# Altium schematic sheet SINUX_F1_POWER.SchDoc
size A4
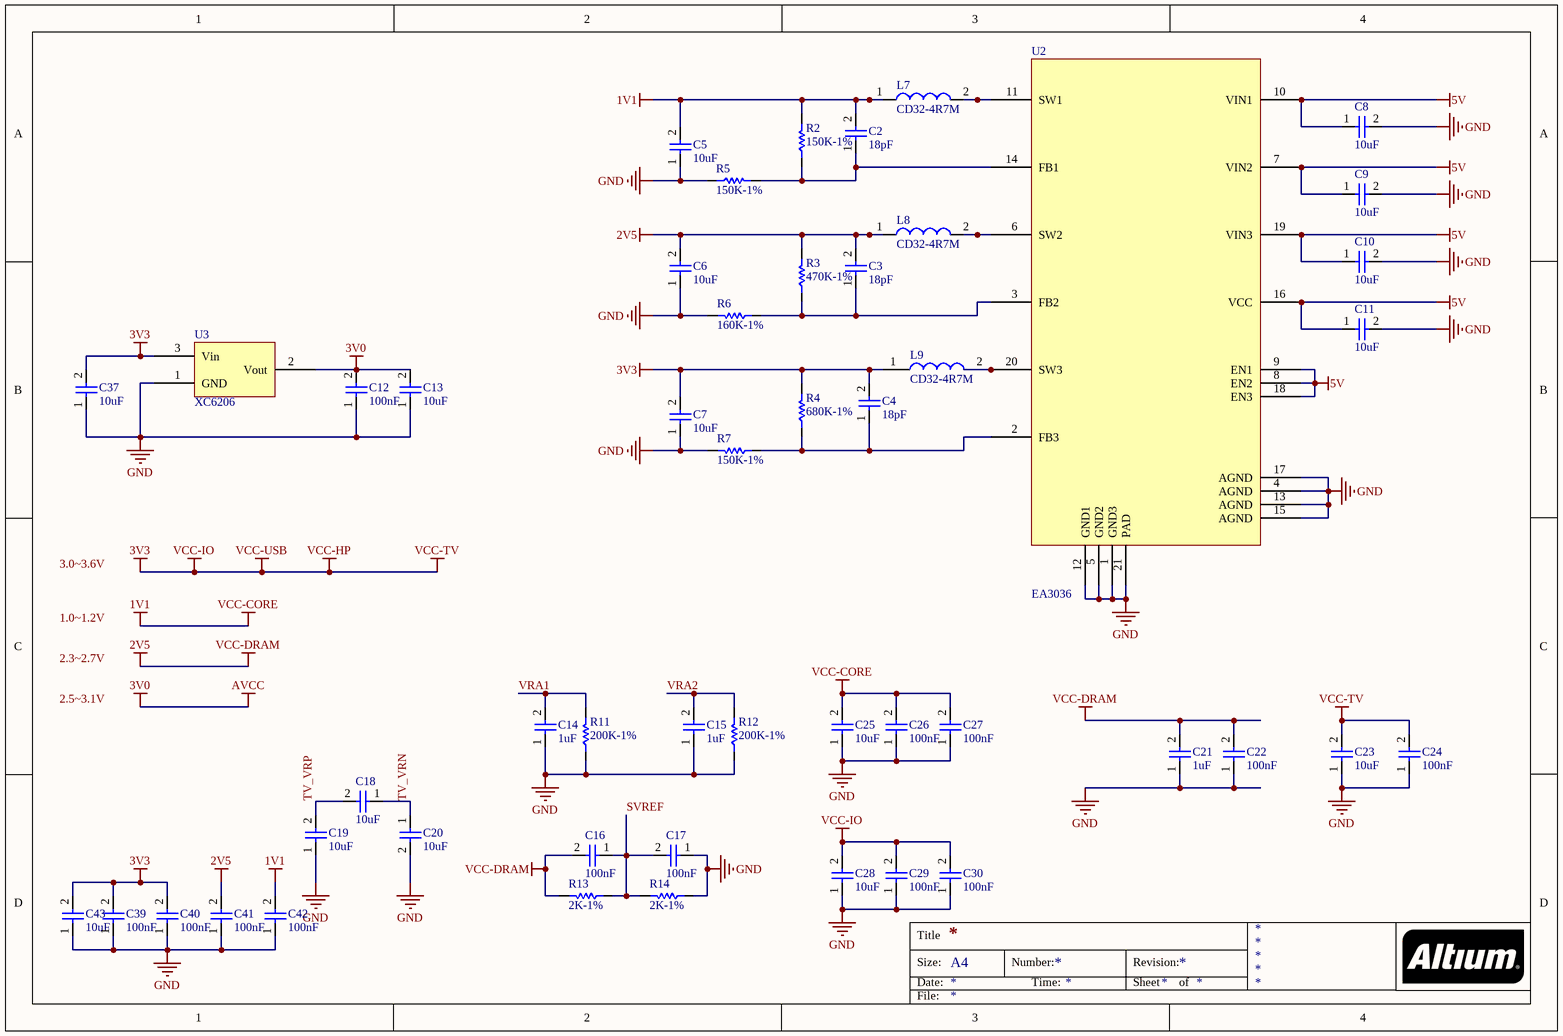
[diagram p0: SINUX_F1_POWER.SchDoc]

## Parts
C2  18pF  [SMD 0805]
C3  18pF  [SMD 0805]
C4  18pF  [SMD 0805]
C5  10uF  [SMD 0805]
C6  10uF  [SMD 0805]
C7  10uF  [SMD 0805]
C8  10uF  [SMD 0805]
C9  10uF  [SMD 0805]
C10  10uF  [SMD 0805]
C11  10uF  [SMD 0805]
C12  100nF  [SMD 0805]
C13  10uF  [SMD 0805]
C14  1uF  [SMD 0805]
C15  1uF  [SMD 0805]
C16  100nF  [SMD 0805]
C17  100nF  [SMD 0805]
C18  10uF  [SMD 0805]
C19  10uF  [SMD 0805]
C20  10uF  [SMD 0805]
C21  1uF  [SMD 0805]
C22  100nF  [SMD 0805]
C23  10uF  [SMD 0805]
C24  100nF  [SMD 0805]
C25  10uF  [SMD 0805]
C26  100nF  [SMD 0805]
C27  100nF  [SMD 0805]
C28  10uF  [SMD 0805]
C29  100nF  [SMD 0805]
C30  100nF  [SMD 0805]
C37  10uF  [SMD 0805]
C39  100nF  [SMD 0805]
C40  100nF  [SMD 0805]
C41  100nF  [SMD 0805]
C42  100nF  [SMD 0805]
C43  10uF  [SMD 0805]
L7  CD32-4R7M  [CD324R7M]
L8  CD32-4R7M  [CD324R7M]
L9  CD32-4R7M  [CD324R7M]
R2  150K-1%  [0805_1/8W]
R3  470K-1%  [0805_1/8W]
R4  680K-1%  [0805_1/8W]
R5  150K-1%  [0805_1/8W]
R6  160K-1%  [0805_1/8W]
R7  150K-1%  [0805_1/8W]
R11  200K-1%  [0805_1/8W]
R12  200K-1%  [0805_1/8W]
R13  2K-1%  [0805_1/8W]
R14  2K-1%  [0805_1/8W]
U2  EA3036  [QFN40P300X300X80-21N]
U3  XC6206  [SOT95P280X130-3N]

## Nets
1V1: C2.2 C5.2 C25.2 C26.2 C27.2 C42.2 L7.1 R2.2  [also labelled VCC-CORE]
2V5: C3.2 C6.2 C16.2 C21.2 C22.2 C41.2 L8.1 R3.2 R13.2  [also labelled VCC-DRAM]
3V0: C12.2 C13.2 U3.2(Vout)  [also labelled AVCC]
3V3: C4.2 C7.2 C23.2 C24.2 C28.2 C29.2 C30.2 C37.2 C39.2 C40.2 C43.2 L9.1 R4.2 U3.3(Vin)  [also labelled VCC-HP, VCC-IO, VCC-TV, VCC-USB]
5V: C8.1 C9.1 C10.1 C11.1 U2.7(VIN2) U2.8(EN2) U2.9(EN1) U2.10(VIN1) U2.16(VCC) U2.18(EN3) U2.19(VIN3)
GND: C5.1 C6.1 C7.1 C8.2 C9.2 C10.2 C11.2 C12.1 C13.1 C14.1 C15.1 C17.1 C19.1 C20.2 C21.1 C22.1 C23.1 C24.1 C25.1 C26.1 C27.1 C28.1 C29.1 C30.1 C37.1 C39.1 C40.1 C41.1 C42.1 C43.1 R5.1 R6.2 R7.2 R11.1 R12.1 R14.1 U2.1(GND3) U2.4(AGND) U2.5(GND2) U2.12(GND1) U2.13(AGND) U2.15(AGND) U2.17(AGND) U2.21(PAD) U3.1(GND)
SVREF: C16.1 C17.2 R13.1 R14.2
TV_VRN: C18.1 C20.1
TV_VRP: C18.2 C19.2
VRA1: C14.2 R11.2
VRA2: C15.2 R12.2
NetC2_1: C2.1 R2.1 R5.2 U2.14(FB1)
NetC3_1: C3.1 R3.1 R6.1 U2.3(FB2)
NetC4_1: C4.1 R4.1 R7.1 U2.2(FB3)
NetL7_2: L7.2 U2.11(SW1)
NetL8_2: L8.2 U2.6(SW2)
NetL9_2: L9.2 U2.20(SW3)

## Notes on the sheet
- Labels drawn without touching a wire or pin: 1.0~1.2V, 2.3~2.7V, 2.5~3.1V, 3.0~3.6V
- Title
- Size:
- Date:
- A4
- Number:
- Time:
- Revision:
- Sheet
- of
- File:

## Library data of the parts
C2-C30 C37 C39-C43 = CAP NON
L7-L9 = CD32-4R7M: Inductor; Manufacturer_Name: Shuo Xing; Datasheet Link: http://aitendo3.sakura.ne.jp/aitendo_data/product_img/parts/coil/CD32/CD32.pdf; Height: 2.4mm; Manufacturer_Part_Number: CD32-4R7M
R2-R7 R11-R14 = RESISTOR